# EAGLE design shift register (EAGLE 9.5.2)
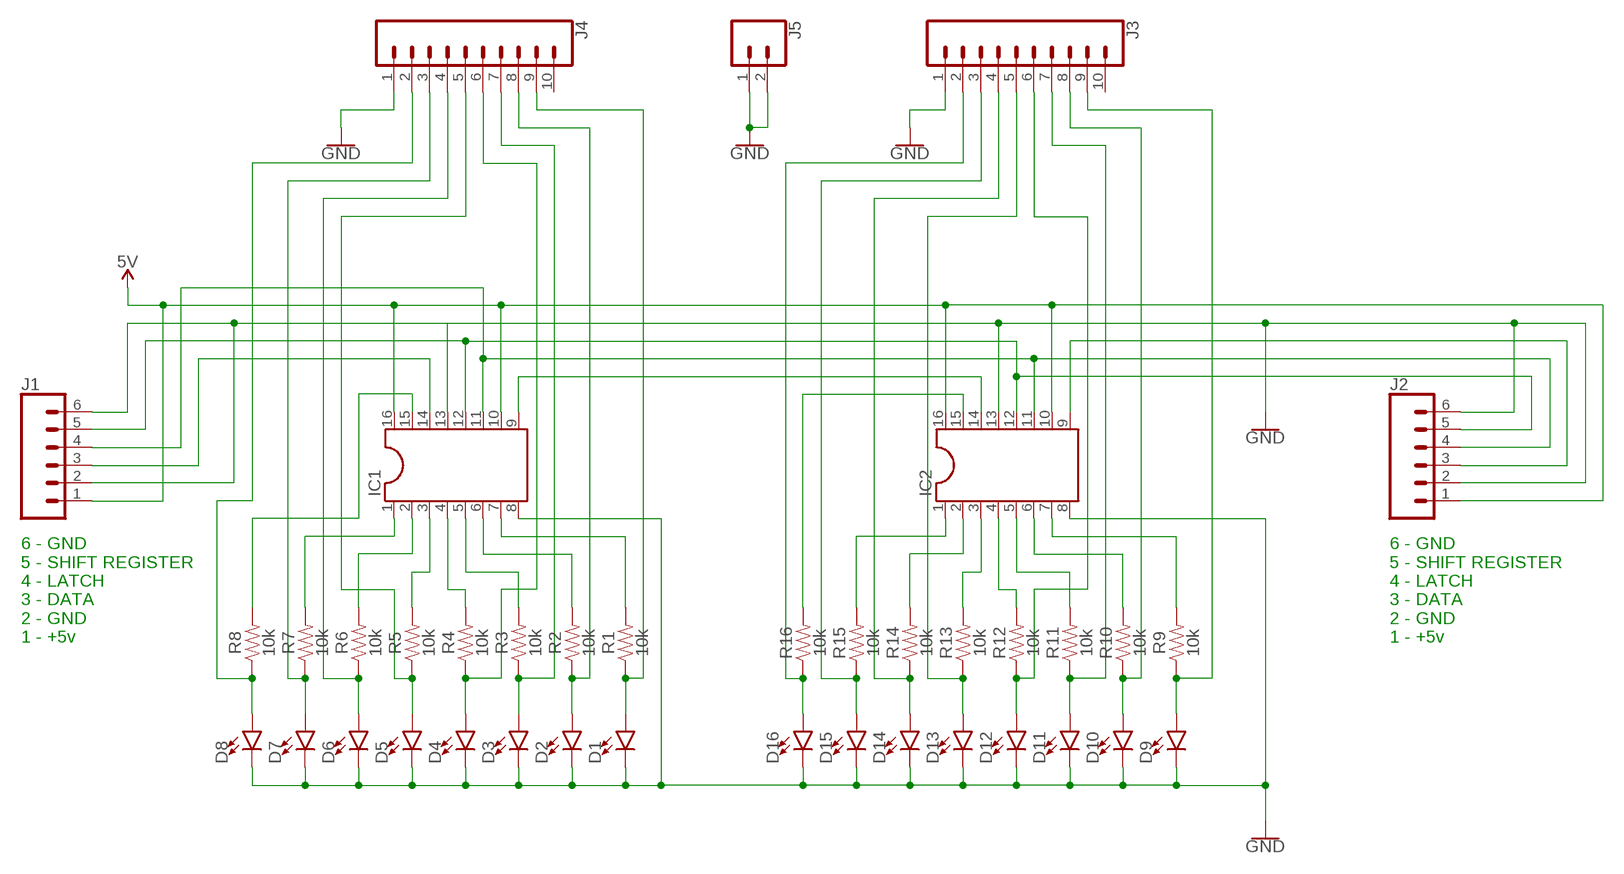
[diagram p0: schematic, sheet 1]

## Parts
D1  LED3MM  [LED_3MM]
D2  LED3MM  [LED_3MM]
D3  LED3MM  [LED_3MM]
D4  LED3MM  [LED_3MM]
D5  LED3MM  [LED_3MM]
D6  LED3MM  [LED_3MM]
D7  LED3MM  [LED_3MM]
D8  LED3MM  [LED_3MM]
D9  LED3MM  [LED_3MM]
D10  LED3MM  [LED_3MM]
D11  LED3MM  [LED_3MM]
D12  LED3MM  [LED_3MM]
D13  LED3MM  [LED_3MM]
D14  LED3MM  [LED_3MM]
D15  LED3MM  [LED_3MM]
D16  LED3MM  [LED_3MM]
IC1  DIL16  [DIL16]
IC2  DIL16  [DIL16]
J1  CONN_06SILK_FEMALE_PTH  [1X06]
J2  CONN_06SILK_FEMALE_PTH  [1X06]
J3  CONN_10"  [1X10]
J4  CONN_10"  [1X10]
J5  CONN_02  [1X02]
R1  10k  10KOHM-HORIZ-1/6W-5%  [AXIAL-0.3]
R2  10k  10KOHM-HORIZ-1/6W-5%  [AXIAL-0.3]
R3  10k  10KOHM-HORIZ-1/6W-5%  [AXIAL-0.3]
R4  10k  10KOHM-HORIZ-1/6W-5%  [AXIAL-0.3]
R5  10k  10KOHM-HORIZ-1/6W-5%  [AXIAL-0.3]
R6  10k  10KOHM-HORIZ-1/6W-5%  [AXIAL-0.3]
R7  10k  10KOHM-HORIZ-1/6W-5%  [AXIAL-0.3]
R8  10k  10KOHM-HORIZ-1/6W-5%  [AXIAL-0.3]
R9  10k  10KOHM-HORIZ-1/6W-5%  [AXIAL-0.3]
R10  10k  10KOHM-HORIZ-1/6W-5%  [AXIAL-0.3]
R11  10k  10KOHM-HORIZ-1/6W-5%  [AXIAL-0.3]
R12  10k  10KOHM-HORIZ-1/6W-5%  [AXIAL-0.3]
R13  10k  10KOHM-HORIZ-1/6W-5%  [AXIAL-0.3]
R14  10k  10KOHM-HORIZ-1/6W-5%  [AXIAL-0.3]
R15  10k  10KOHM-HORIZ-1/6W-5%  [AXIAL-0.3]
R16  10k  10KOHM-HORIZ-1/6W-5%  [AXIAL-0.3]

## Nets
5V: IC1.10 IC1.16 IC2.10 IC2.16 J1.1 J2.1
GND: D1.K(C) D2.K(C) D3.K(C) D4.K(C) D5.K(C) D6.K(C) D7.K(C) D8.K(C) D9.K(C) D10.K(C) D11.K(C) D12.K(C) D13.K(C) D14.K(C) D15.K(C) D16.K(C) IC1.8 IC1.13 IC2.8 IC2.13 J1.2 J1.6 J2.2 J2.6 J3.1 J4.1 J5.1 J5.2
N$1: IC1.7 R1.P$2
N$2: D9.A J3.9 R9.P$1
N$4: D7.A J4.3 R7.P$1
N$5: D6.A J4.4 R6.P$1
N$6: D5.A J4.5 R5.P$1
N$7: D4.A J4.6 R4.P$1
N$8: D3.A J4.7 R3.P$1
N$9: D2.A J4.8 R2.P$1
N$10: D10.A J3.8 R10.P$1
N$11: D11.A J3.7 R11.P$1
N$12: D12.A J3.6 R12.P$1
N$13: D13.A J3.5 R13.P$1
N$14: D14.A J3.4 R14.P$1
N$15: D15.A J3.3 R15.P$1
N$16: D16.A J3.2 R16.P$1
N$19: IC1.15 R8.P$2
N$20: IC2.15 R16.P$2
N$21: D8.A J4.2 R8.P$1
N$22: IC1.6 R2.P$2
N$30: IC2.7 R9.P$2
N$31: IC2.6 R10.P$2
N$33: IC1.9 IC2.14
N$34: IC1.11 IC2.11 J1.4 J2.4
N$35: IC1.12 IC2.12 J1.5 J2.5
N$36: IC1.14 J1.3
N$37: IC2.9 J2.3
N$38: D1.A J4.9 R1.P$1
N$39: IC1.4 R4.P$2
N$40: IC1.5 R3.P$2
N$42: IC1.3 R5.P$2
N$43: IC1.2 R6.P$2
N$44: IC1.1 R7.P$2
N$46: IC2.1 R15.P$2
N$47: IC2.2 R14.P$2
N$48: IC2.3 R13.P$2
N$49: IC2.4 R12.P$2
N$50: IC2.5 R11.P$2
Unconnected: J3.10 J4.10

## Notes on the sheet
- 6 - GND
  5 - SHIFT REGISTER
  4 - LATCH
  3 - DATA
  2 - GND
  1 - +5v
- 6 - GND
  5 - SHIFT REGISTER
  4 - LATCH
  3 - DATA
  2 - GND
  1 - +5v

## Library data of the parts
D1-D16 = SparkFun-LED:LED: LED (Generic) Standard schematic elements and footprints for 5mm, 3mm, 1206, and 0603 sized LEDs. Generic LEDs with no color specified.; PROD_ID: DIO-08794
IC1 IC2 = ic-package:DIL16: Dual In Line / Socket
J1 J2 = SparkFun-Connectors:CONN_06: Multi connection point. Often used as Generic Header-pin footprint for 0.1 inch spaced/style header connections On any of the 0.1 inch spaced packages, you can populate with these: Break Away Headers - Straight <https://www.sparkfun.com/products/116> (PRT-00116) Break Away Male Headers - Right Angle <https://www.sparkfun.com/products/553> (PRT-00553) Female Headers <https://www.sparkfun.com/products/115> (PRT-00115) Break Away Headers - Machine Pin <https://www.sparkfun.com/products/117> (PRT-00117) Break Away Female Headers - Swiss Machine Pin <https://www.sparkfun.com/products/743> (PRT-00743) Arduino Stackable Header - 6 Pin <https://www.sparkfun.com/products/9280> (PRT-09280) For SCREWTERMINALS and SPRING TERMINALS visit here: Screw Terimnals on SparkFun.com <https://www.sparkfun.com/search/results?term=Screw+Terminals> (5mm/3.5mm/2.54mm spacing) This device is also useful as a general connection point to wire up your design to another part of your project. Our various solder wires solder well into these plated through hole pads. Hook-Up Wire - Assortment (Stranded, 22 AWG) <https://www.sparkfun.com/products/11375> (PRT-11375) Hook-Up Wire - Assortment (Solid Core, 22 AWG) <https://www.sparkfun.com/products/11367> (PRT-11367) View the entire wire category on our website here <https://www.sparkfun.com/categories/141>; PROD_ID: CONN-08437
J3 J4 = SparkFun-Connectors:CONN_10: Multi connection point. Often used as Generic Header-pin footprint for 0.1 inch spaced/style header connections On any of the 0.1 inch spaced packages, you can populate with these: Break Away Headers - Straight <https://www.sparkfun.com/products/116> (PRT-00116) Break Away Male Headers - Right Angle <https://www.sparkfun.com/products/553> (PRT-00553) Female Headers <https://www.sparkfun.com/products/115> (PRT-00115) Break Away Headers - Machine Pin <https://www.sparkfun.com/products/117> (PRT-00117) Break Away Female Headers - Swiss Machine Pin <https://www.sparkfun.com/products/743> (PRT-00743) Arduino Stackable Header - 10 Pin <https://www.sparkfun.com/products/11376> (PRT-11376) For SCREWTERMINALS and SPRING TERMINALS visit here: Screw Terimnals on SparkFun.com <https://www.sparkfun.com/search/results?term=Screw+Terminals> (5mm/3.5mm/2.54mm spacing) This device is also useful as a general connection point to wire up your design to another part of your project. Our various solder wires solder well into these plated through hole pads. Hook-Up Wire - Assortment (Stranded, 22 AWG) <https://www.sparkfun.com/products/11375> (PRT-11375) Hook-Up Wire - Assortment (Solid Core, 22 AWG) <https://www.sparkfun.com/products/11367> (PRT-11367) View the entire wire category on our website here <https://www.sparkfun.com/categories/141> Special notes: Molex polarized connector foot print use with SKU : PRT-08231 with associated crimp pins and housings. 1MM SMD Version SKU: PRT-10208 NOTES ON THE VARIANTS LOCK and LOCK_LONGPADS... This footprint was designed to help hold the alignment of a through-hole component (i.e. 6-pin header) while soldering it into place. You may notice that each hole has been shifted either up or down by 0.005 of an inch from it's more standard position (which is a perfectly straight line). This slight alteration caused the pins (the squares in the middle) to touch the edges of the holes. Because they are alternating, it causes a "brace" to hold the component in place. 0.005 has proven to be the perfect amount of "off-center" position when using our standard breakaway headers. Although looks a little odd when you look at the bare footprint, once you have a header in there, the alteration is very hard to notice. Also,if you push a header all the way into place, it is covered up entirely on the bottom side.; PROD_ID: CONN-11563
J5 = SparkFun-Connectors:CONN_02: Multi connection point. Often used as Generic Header-pin footprint for 0.1 inch spaced/style header connections On any of the 0.1 inch spaced packages, you can populate with these: Break Away Headers - Straight <https://www.sparkfun.com/products/116> (PRT-00116) Break Away Male Headers - Right Angle <https://www.sparkfun.com/products/553> (PRT-00553) Female Headers <https://www.sparkfun.com/products/115> (PRT-00115) Break Away Headers - Machine Pin <https://www.sparkfun.com/products/117> (PRT-00117) Break Away Female Headers - Swiss Machine Pin <https://www.sparkfun.com/products/743> (PRT-00743) For SCREWTERMINALS and SPRING TERMINALS visit here: Screw Terimnals on SparkFun.com <https://www.sparkfun.com/search/results?term=Screw+Terminals> (5mm/3.5mm/2.54mm spacing) This device is also useful as a general connection point to wire up your design to another part of your project. Our various solder wires solder well into these plated through hole pads. Hook-Up Wire - Assortment (Stranded, 22 AWG) <https://www.sparkfun.com/products/11375> (PRT-11375) Hook-Up Wire - Assortment (Solid Core, 22 AWG) <https://www.sparkfun.com/products/11367> (PRT-11367) View the entire wire category on our website here <https://www.sparkfun.com/categories/141> Special notes: Molex polarized connector foot print use with: PRT-08233 with associated crimp pins and housings. 2.54_SCREWTERM for use with PRT-10571. 3.5mm Screw Terminal footprints for PRT-08084 5mm Screw Terminal footprints for use with PRT-08432
R1-R16 = SparkFun-Resistors:10KOHM: 10kΩ resistor A resistor is a passive two-terminal electrical component that implements electrical resistance as a circuit element. Resistors act to reduce current flow, and, at the same time, act to lower voltage levels within circuits. - Wikipedia; PROD_ID: RES-08375

## Board
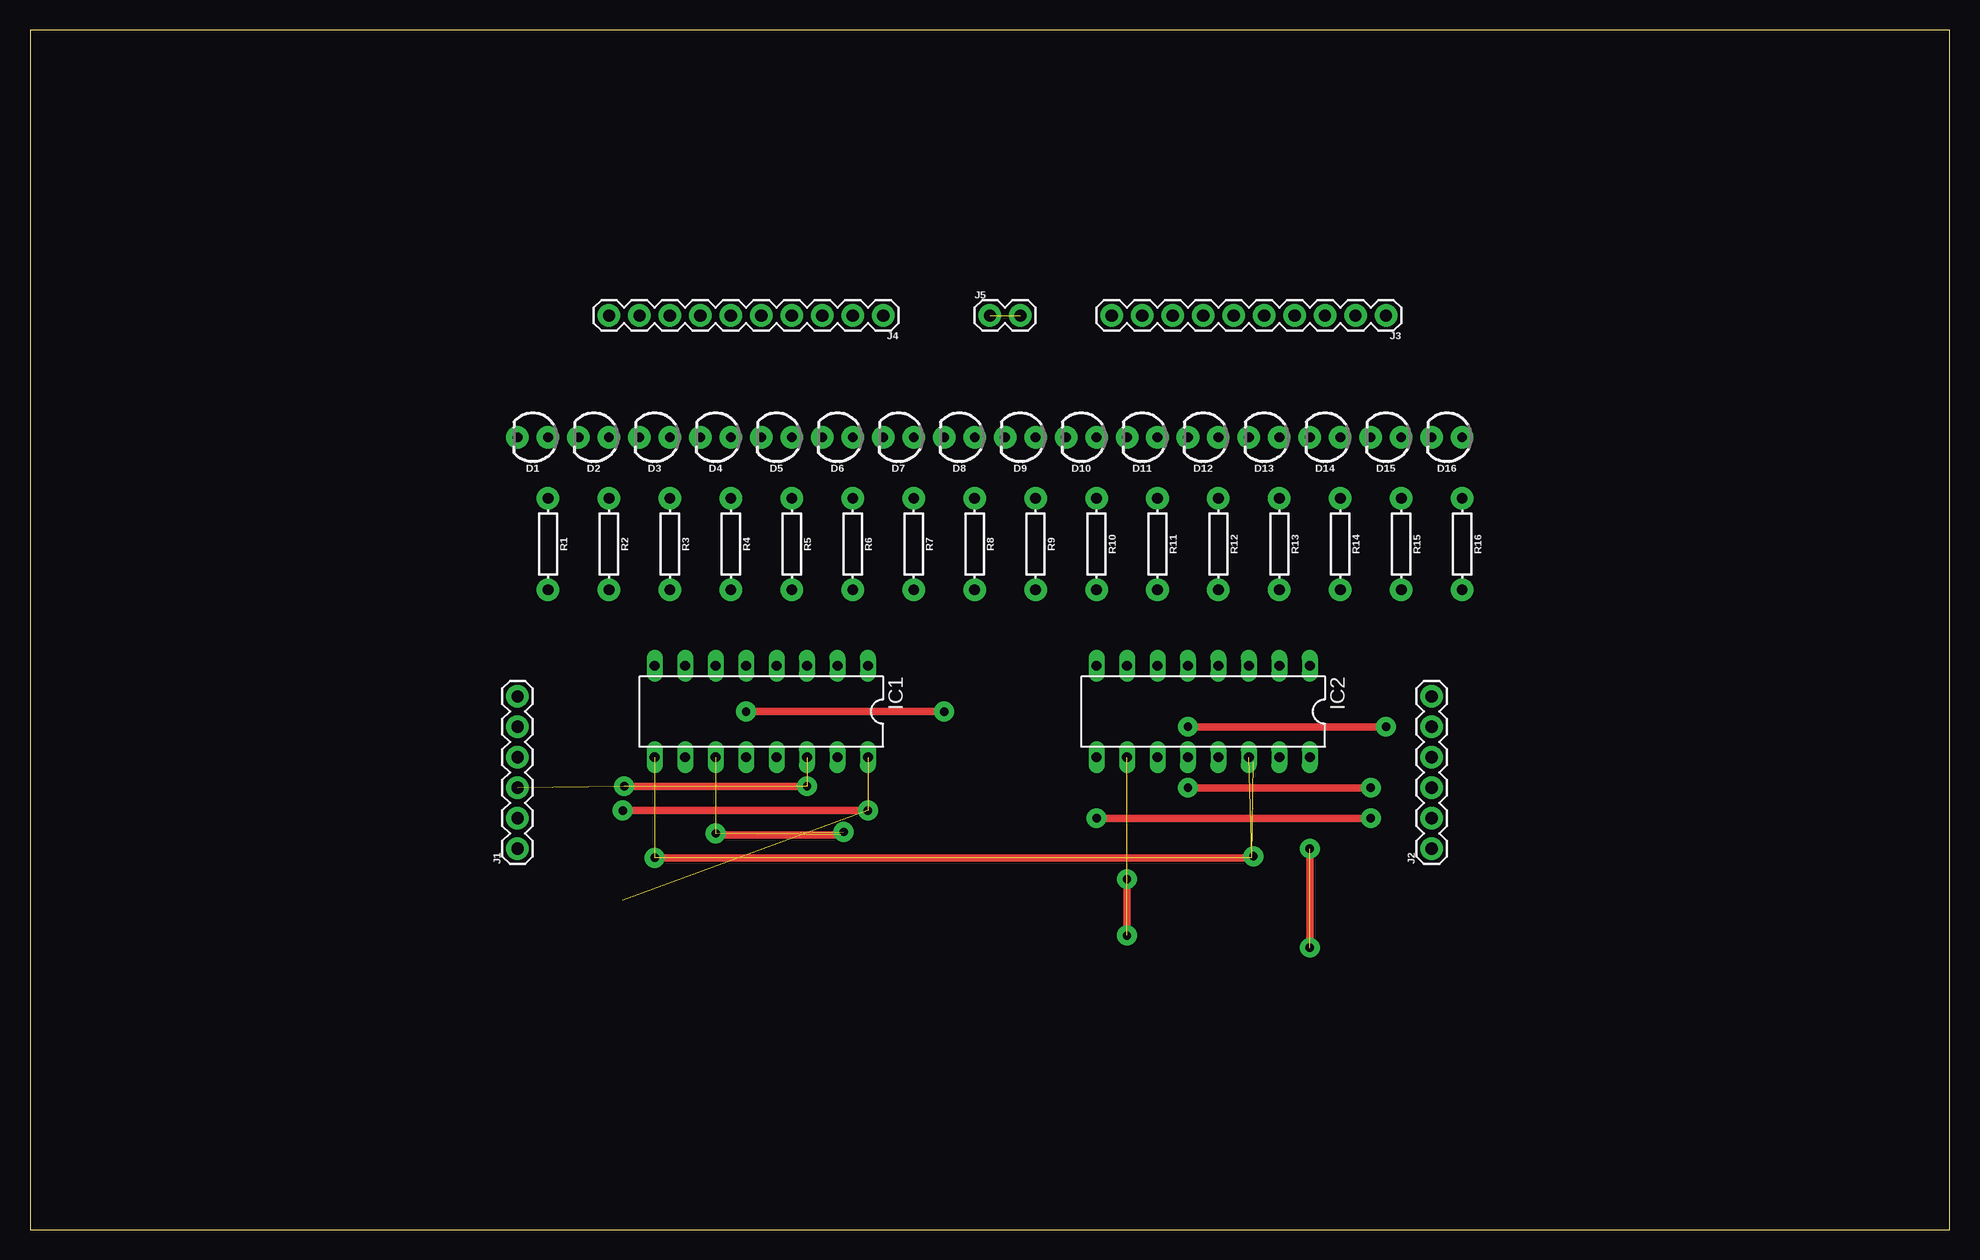
[diagram p1: board, top side]
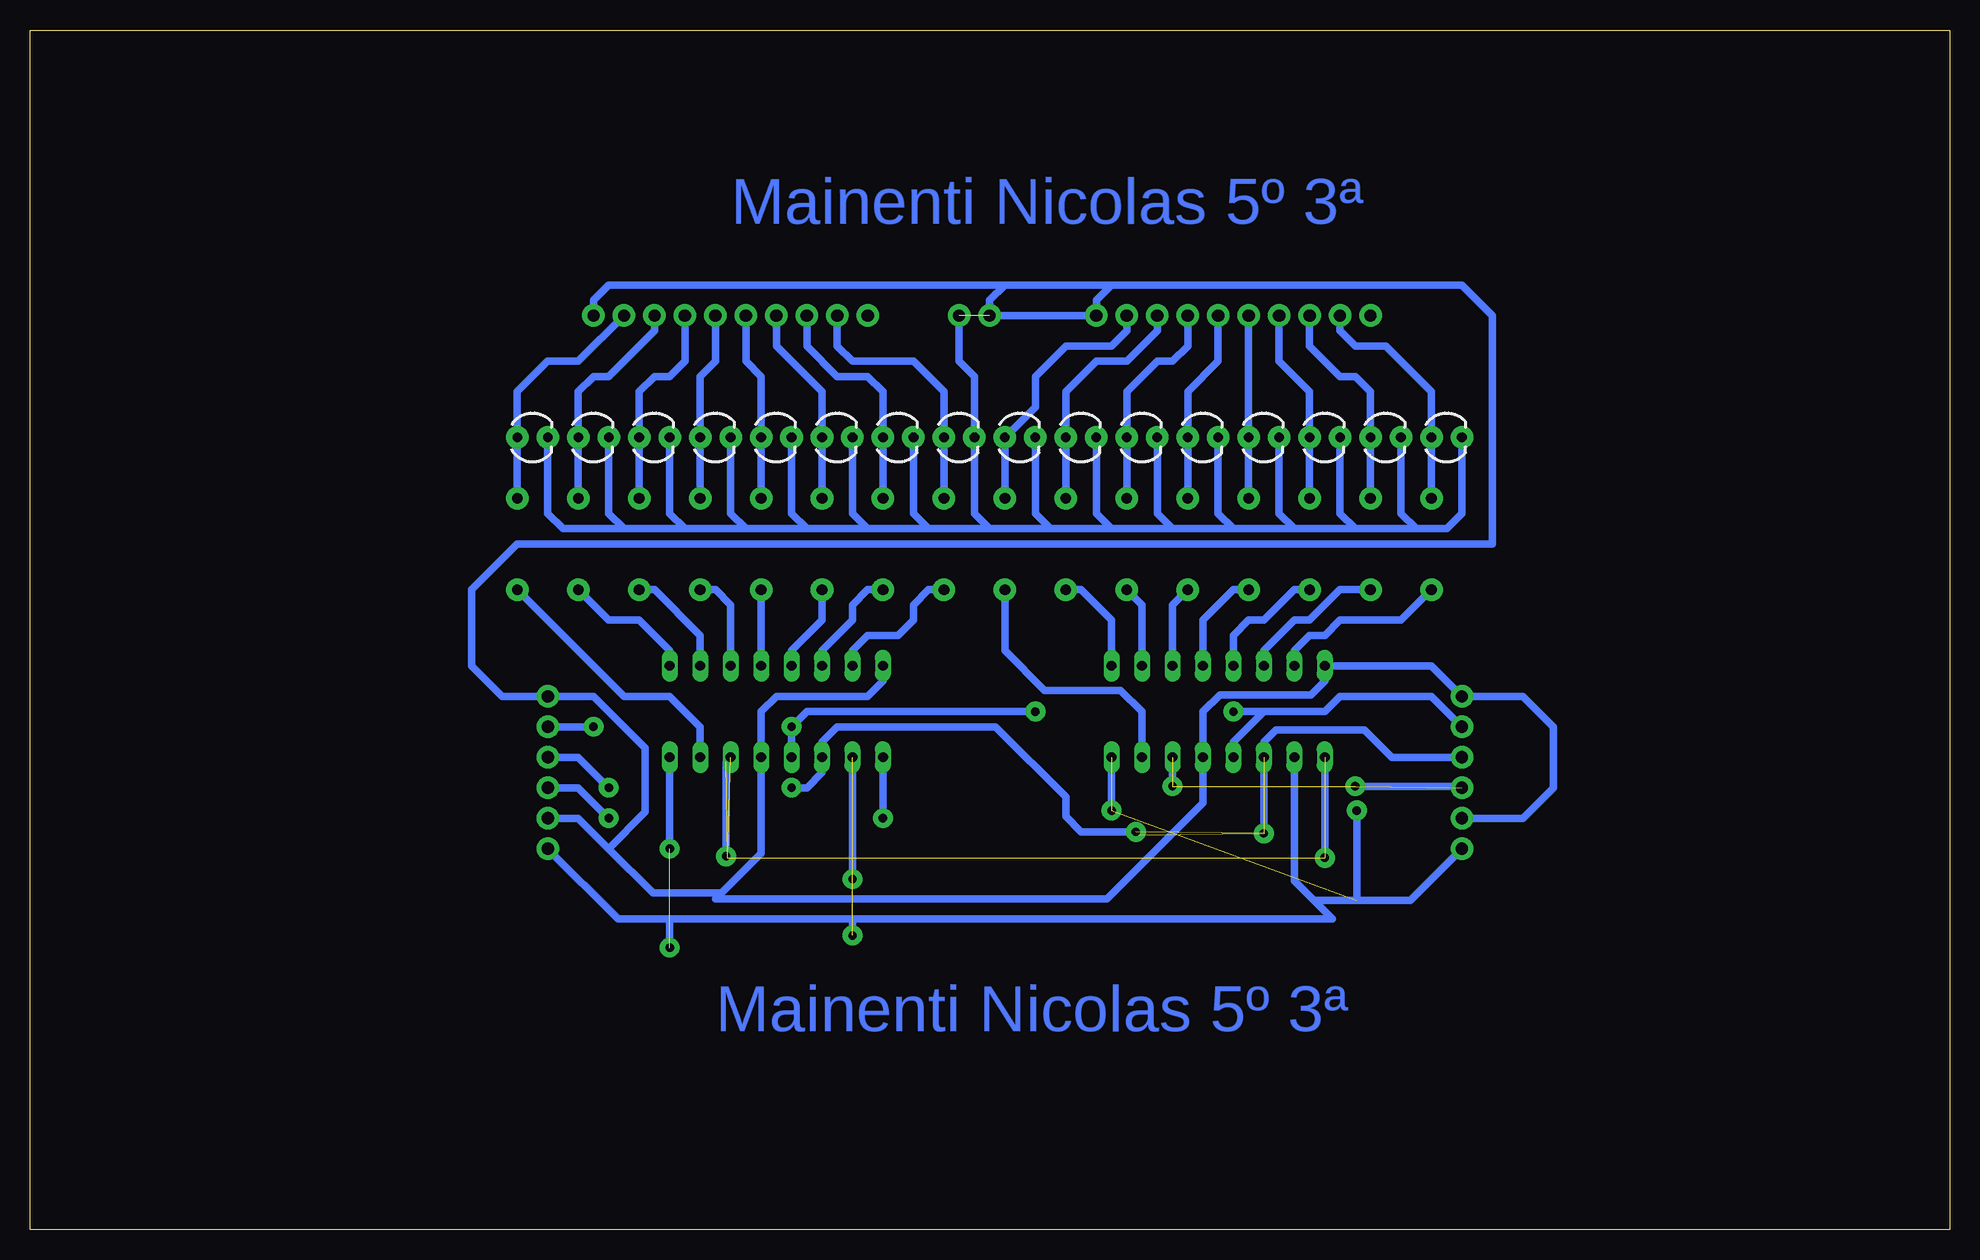
[diagram p2: board, bottom side, seen from below]

Size 160 x 100 mm. Coordinates in mm from the lower left corner, seen from the top.
Outline: 0,0 160,0 160,100 0,100 0,0
Copper layers (1*16): Top 0.035mm / dielectric 1.5mm / Bottom 0.035mm
Design rules "default *": minimum track width 24mil, minimum drill 0.35mm, track to track 16mil, track to pad 6mil, pad to pad 6mil, via to via 6mil, smd to smd 6mil, copper to edge 40mil, drill to drill 6mil, minimum pad ring 10mil, minimum via ring 8mil, stop-mask expansion 4mil, vias tented up to drill 0mil, thermal gap 10mil

### Footprints (pad centres in the part's own frame; a part is rotated, then mirrored left to right if it is on the bottom)
LED_3MM = drill 0.813 pad 1.88: A -1.27,0; K 1.27,0
DIL16 = drill 0.813 long: 1 -8.89,-3.81; 2 -6.35,-3.81; 3 -3.81,-3.81; 4 -1.27,-3.81; 5 1.27,-3.81; 6 3.81,-3.81; 7 6.35,-3.81; 8 8.89,-3.81; 9 8.89,3.81; 10 6.35,3.81; 11 3.81,3.81; 12 1.27,3.81; 13 -1.27,3.81; 14 -3.81,3.81; 15 -6.35,3.81; 16 -8.89,3.81
1X06 = drill 1.016 pad 1.88: 1 0,0; 2 2.54,0; 3 5.08,0; 4 7.62,0; 5 10.16,0; 6 12.7,0
1X10 = drill 1.016 pad 1.88: 1 0,0; 2 2.54,0; 3 5.08,0; 4 7.62,0; 5 10.16,0; 6 12.7,0; 7 15.24,0; 8 17.78,0; 9 20.32,0; 10 22.86,0
1X02 = drill 1.016 pad 1.88: 1 0,0; 2 2.54,0
AXIAL-0.3 = drill 0.9 pad 1.88: P$1 -3.81,0; P$2 3.81,0

### Placement (x,y rotation side)
D1  41.91,66.04 180 top
D2  46.99,66.04 180 top
D3  52.07,66.04 180 top
D4  57.15,66.04 180 top
D5  62.23,66.04 180 top
D6  67.31,66.04 180 top
D7  72.39,66.04 180 top
D8  77.47,66.04 180 top
D9  82.55,66.04 180 top
D10  87.63,66.04 180 top
D11  92.71,66.04 180 top
D12  97.79,66.04 180 top
D13  102.87,66.04 180 top
D14  107.95,66.04 180 top
D15  113.03,66.04 180 top
D16  118.11,66.04 180 top
IC1  60.96,43.18 180 top
IC2  97.79,43.18 180 top
J1  40.64,31.75 90 top
J2  116.84,31.75 90 top
J3  113.03,76.2 180 top
J4  71.12,76.2 180 top
J5  80.01,76.2 0 top
R1  43.18,57.15 270 top
R2  48.26,57.15 270 top
R3  53.34,57.15 270 top
R4  58.42,57.15 270 top
R5  63.5,57.15 270 top
R6  68.58,57.15 270 top
R7  73.66,57.15 270 top
R8  78.74,57.15 270 top
R9  83.82,57.15 270 top
R10  88.9,57.15 270 top
R11  93.98,57.15 270 top
R12  99.06,57.15 270 top
R13  104.14,57.15 270 top
R14  109.22,57.15 270 top
R15  114.3,57.15 270 top
R16  119.38,57.15 270 top

### Tracks (layer width: path | path; a pad name or v marks a point on that pad's centre or on a via)
5V  (via drill 0.35, 0.7 pad 1.65)  (14 unrouted)
  Top 0.61: v106.68,23.5 v106.68,31.75 v106.68,31.88 | v69.85,34.92 v49.4,34.92 | v91.44,29.21 v91.44,24.51
  Bottom 0.61: J1.1 44.96,27.43 49.4,27.43 | 52.96,27.43 49.4,27.43 | 91.44,25.91 51.44,25.91 52.96,27.43 | 91.44,25.91 106.68,25.91 | 106.68,25.91 111,25.91 J2.1 | IC1.10 54.61,29.08 52.96,27.43 | IC2.16 v106.68,31.88 | v106.68,23.5 106.68,25.91 | v91.44,24.51 91.44,25.91 | IC1.16 v69.85,34.92 | v49.4,34.92 49.4,27.43 | IC2.10 v91.44,29.21
GND  (1 unrouted)
  Bottom 0.61: J2.2 114.3,34.29 111.76,31.75 | 69.85,78.74 71.12,77.47 J4.1 J5.1 80.01,77.47 78.74,78.74 | 69.85,78.74 40.64,78.74 38.1,76.2 38.1,57.15 119.38,57.15 123.19,53.34 123.19,46.99 120.65,44.45 J2.6 113.03,44.45 108.71,40.13 108.71,34.8 111.76,31.75 | 69.85,78.74 78.74,78.74 | 78.74,78.74 111.76,78.74 113.03,77.47 J3.1 | D1.K 40.64,59.69 41.91,58.42 44.45,58.42 | 44.45,58.42 49.53,58.42 | 49.53,58.42 54.61,58.42 | 54.61,58.42 59.69,58.42 | 59.69,58.42 64.77,58.42 | 64.77,58.42 69.85,58.42 | 69.85,58.42 74.93,58.42 | 74.93,58.42 80.01,58.42 | 80.01,58.42 85.09,58.42 | 85.09,58.42 90.17,58.42 | 90.17,58.42 95.25,58.42 | 95.25,58.42 100.33,58.42 | 100.33,58.42 105.41,58.42 | 105.41,58.42 110.49,58.42 | 110.49,58.42 115.57,58.42 116.84,59.69 D16.K | D15.K 111.76,59.69 110.49,58.42 | D14.K 106.68,59.69 105.41,58.42 | D13.K 101.6,59.69 100.33,58.42 | D12.K 96.52,59.69 95.25,58.42 | D11.K 91.44,59.69 90.17,58.42 | D10.K 86.36,59.69 85.09,58.42 | 80.01,58.42 81.28,59.69 D9.K 81.28,71.12 82.55,72.39 J5.2 | D8.K 76.2,59.69 74.93,58.42 | D7.K 71.12,59.69 69.85,58.42 | D6.K 66.04,59.69 64.77,58.42 | D5.K 60.96,59.69 59.69,58.42 | D4.K 55.88,59.69 54.61,58.42 | D3.K 50.8,59.69 49.53,58.42 | D2.K 45.72,59.69 44.45,58.42 | J1.2 35.56,34.29 33.02,36.83 33.02,41.91 35.56,44.45 J1.6 43.18,46.99 IC1.8 52.07,45.72 53.21,44.58 60.83,44.58 62.23,43.18 IC1.13 62.23,35.56 70.23,27.56 102.87,27.56 102.36,28.07 | IC2.8 88.9,45.72 90.17,44.45 97.79,44.45 99.06,43.18 IC2.13 99.06,31.37 102.36,28.07 | 111.76,31.75 108.08,28.07 102.36,28.07
N$1
  Bottom 0.61: R1.P$2 45.72,50.8 50.8,50.8 52.07,49.53 53.34,49.53 54.61,48.26 IC1.7
N$2
  Bottom 0.61: R9.P$1 D9.A 83.82,69.85 86.36,72.39 91.44,72.39 92.71,73.66 J3.9
N$4
  Bottom 0.61: R7.P$1 D7.A 73.66,69.85 71.12,72.39 68.58,72.39 66.04,74.93 J4.3
N$5
  Bottom 0.61: R6.P$1 D6.A 68.58,69.85 66.04,72.39 64.77,72.39 63.5,73.66 J4.4
N$6
  Bottom 0.61: R5.P$1 D5.A 63.5,69.85 60.96,72.39 J4.5
N$7
  Bottom 0.61: J4.6 D4.A R4.P$1
N$8
  Bottom 0.61: R3.P$1 D3.A 53.34,69.85 55.88,72.39 J4.7
N$9
  Bottom 0.61: R2.P$1 D2.A 48.26,69.85 49.53,71.12 50.8,71.12 53.34,73.66 J4.8
N$10
  Bottom 0.61: R10.P$1 D10.A 88.9,69.85 90.17,71.12 92.71,71.12 95.25,73.66 J3.8
N$11
  Bottom 0.61: R11.P$1 D11.A 93.98,69.85 97.79,73.66 J3.7
N$12
  Bottom 0.61: R12.P$1 D12.A 99.06,71.12 100.33,72.39 J3.6
N$13
  Bottom 0.61: R13.P$1 D13.A 104.14,71.12 102.87,72.39 J3.5
N$14
  Bottom 0.61: R14.P$1 D14.A 109.22,69.85 107.95,71.12 106.68,71.12 105.41,72.39 J3.4
N$15
  Bottom 0.61: R15.P$1 D15.A 114.3,69.85 113.03,71.12 111.76,71.12 107.95,74.93 J3.3
N$16
  Bottom 0.61: R16.P$1 D16.A 119.38,69.85 116.84,72.39 114.3,72.39 J3.2
N$19
  Bottom 0.61: R8.P$2 78.74,48.26 75.44,44.96 69.09,44.96 67.31,43.18 IC1.15
N$20
  Bottom 0.61: R16.P$2 110.49,44.45 106.68,44.45 104.14,41.91 IC2.15
N$21
  Bottom 0.61: R8.P$1 D8.A 76.2,68.58 76.2,71.12 73.66,73.66 69.85,73.66 68.58,74.93 J4.2
N$22
  Bottom 0.61: R2.P$2 50.8,53.34 53.34,50.8 54.61,50.8 57.15,48.26 IC1.6
N$30
  Bottom 0.61: R9.P$2 85.09,53.34 86.36,52.07 86.36,50.8 87.63,49.53 90.17,49.53 91.44,48.26 IC2.7
N$31
  Bottom 0.61: R10.P$2 90.17,53.34 91.44,52.07 91.44,50.8 93.98,48.26 IC2.6
N$33  (via drill 0.35, 0.7 pad 1.65)  (6 unrouted)
  Top 0.61: v101.98,31.11 101.85,30.99 v52.07,30.99
  Bottom 0.61: IC1.9 v52.07,30.99 | IC2.14 101.98,38.99 v101.98,31.11
N$34  (via drill 0.35, 0.7 pad 1.65)  (5 unrouted)
  Top 0.61: v111.76,36.83 v96.52,36.83 | v67.94,33.15 v67.82,33.15 67.56,32.89 57.28,32.89 v57.15,33.02
  Bottom 0.61: J1.4 46.48,39.37 48.77,41.66 56.13,41.66 57.15,40.64 IC1.11 v57.15,33.02 | v67.94,33.15 72.39,33.15 73.66,34.42 73.66,36.07 79.5,41.91 92.71,41.91 93.98,40.64 IC2.11 93.98,38.1 95.25,36.83 v96.52,36.83 | J2.4 114.3,39.37 v111.76,36.83
N$35  (via drill 0.35, 0.7 pad 1.65)
  Top 0.61: v113.03,41.91 v96.52,41.91 | v59.69,43.18 v76.2,43.18
  Bottom 0.61: J1.5 43.18,44.45 50.8,44.45 52.07,43.18 57.15,43.18 | 57.15,43.18 59.69,40.64 IC1.12 | 57.15,43.18 v59.69,43.18 | v76.2,43.18 95.25,43.18 v96.52,41.91 IC2.12 | J2.5 v113.03,41.91
N$36  (via drill 0.35, 0.7 pad 1.65)  (5 unrouted)
  Top 0.61: v64.77,36.96 v49.53,36.96
  Bottom 0.61: v49.53,36.96 40.77,36.96 J1.3 | IC1.14 v64.77,36.96
N$37  (via drill 0.35, 0.7 pad 1.65)
  Top 0.61: v88.9,34.29 v111.76,34.29
  Bottom 0.61: IC2.9 v88.9,34.29 | v111.76,34.29 114.3,36.83 J2.3
N$38
  Bottom 0.61: R1.P$1 D1.A 43.18,69.85 46.99,73.66 49.53,73.66 50.8,74.93 J4.9
N$39
  Bottom 0.61: R4.P$2 59.69,53.34 62.23,50.8 IC1.4
N$40
  Bottom 0.61: R3.P$2 54.61,53.34 57.15,50.8 58.42,50.8 59.69,49.53 IC1.5
N$42
  Bottom 0.61: R5.P$2 64.77,52.07 IC1.3
N$43
  Bottom 0.61: R6.P$2 67.31,52.07 IC1.2
N$44
  Bottom 0.61: R7.P$2 72.39,53.34 69.85,50.8 IC1.1
N$46
  Bottom 0.61: R15.P$2 111.76,50.8 109.22,50.8 106.68,48.26 IC2.1
N$47
  Bottom 0.61: R14.P$2 107.95,53.34 104.14,49.53 IC2.2
N$48
  Bottom 0.61: R13.P$2 102.87,53.34 101.6,52.07 IC2.3
N$49
  Bottom 0.61: R12.P$2 IC2.4
N$50
  Bottom 0.61: R11.P$2 93.98,50.8 96.52,48.26 IC2.5

### Text on the board
Bottom: Mainenti Nicolas 5º 3ª | Mainenti Nicolas 5º 3ª